# EAGLE design lorasniff (EAGLE 7.7.0)
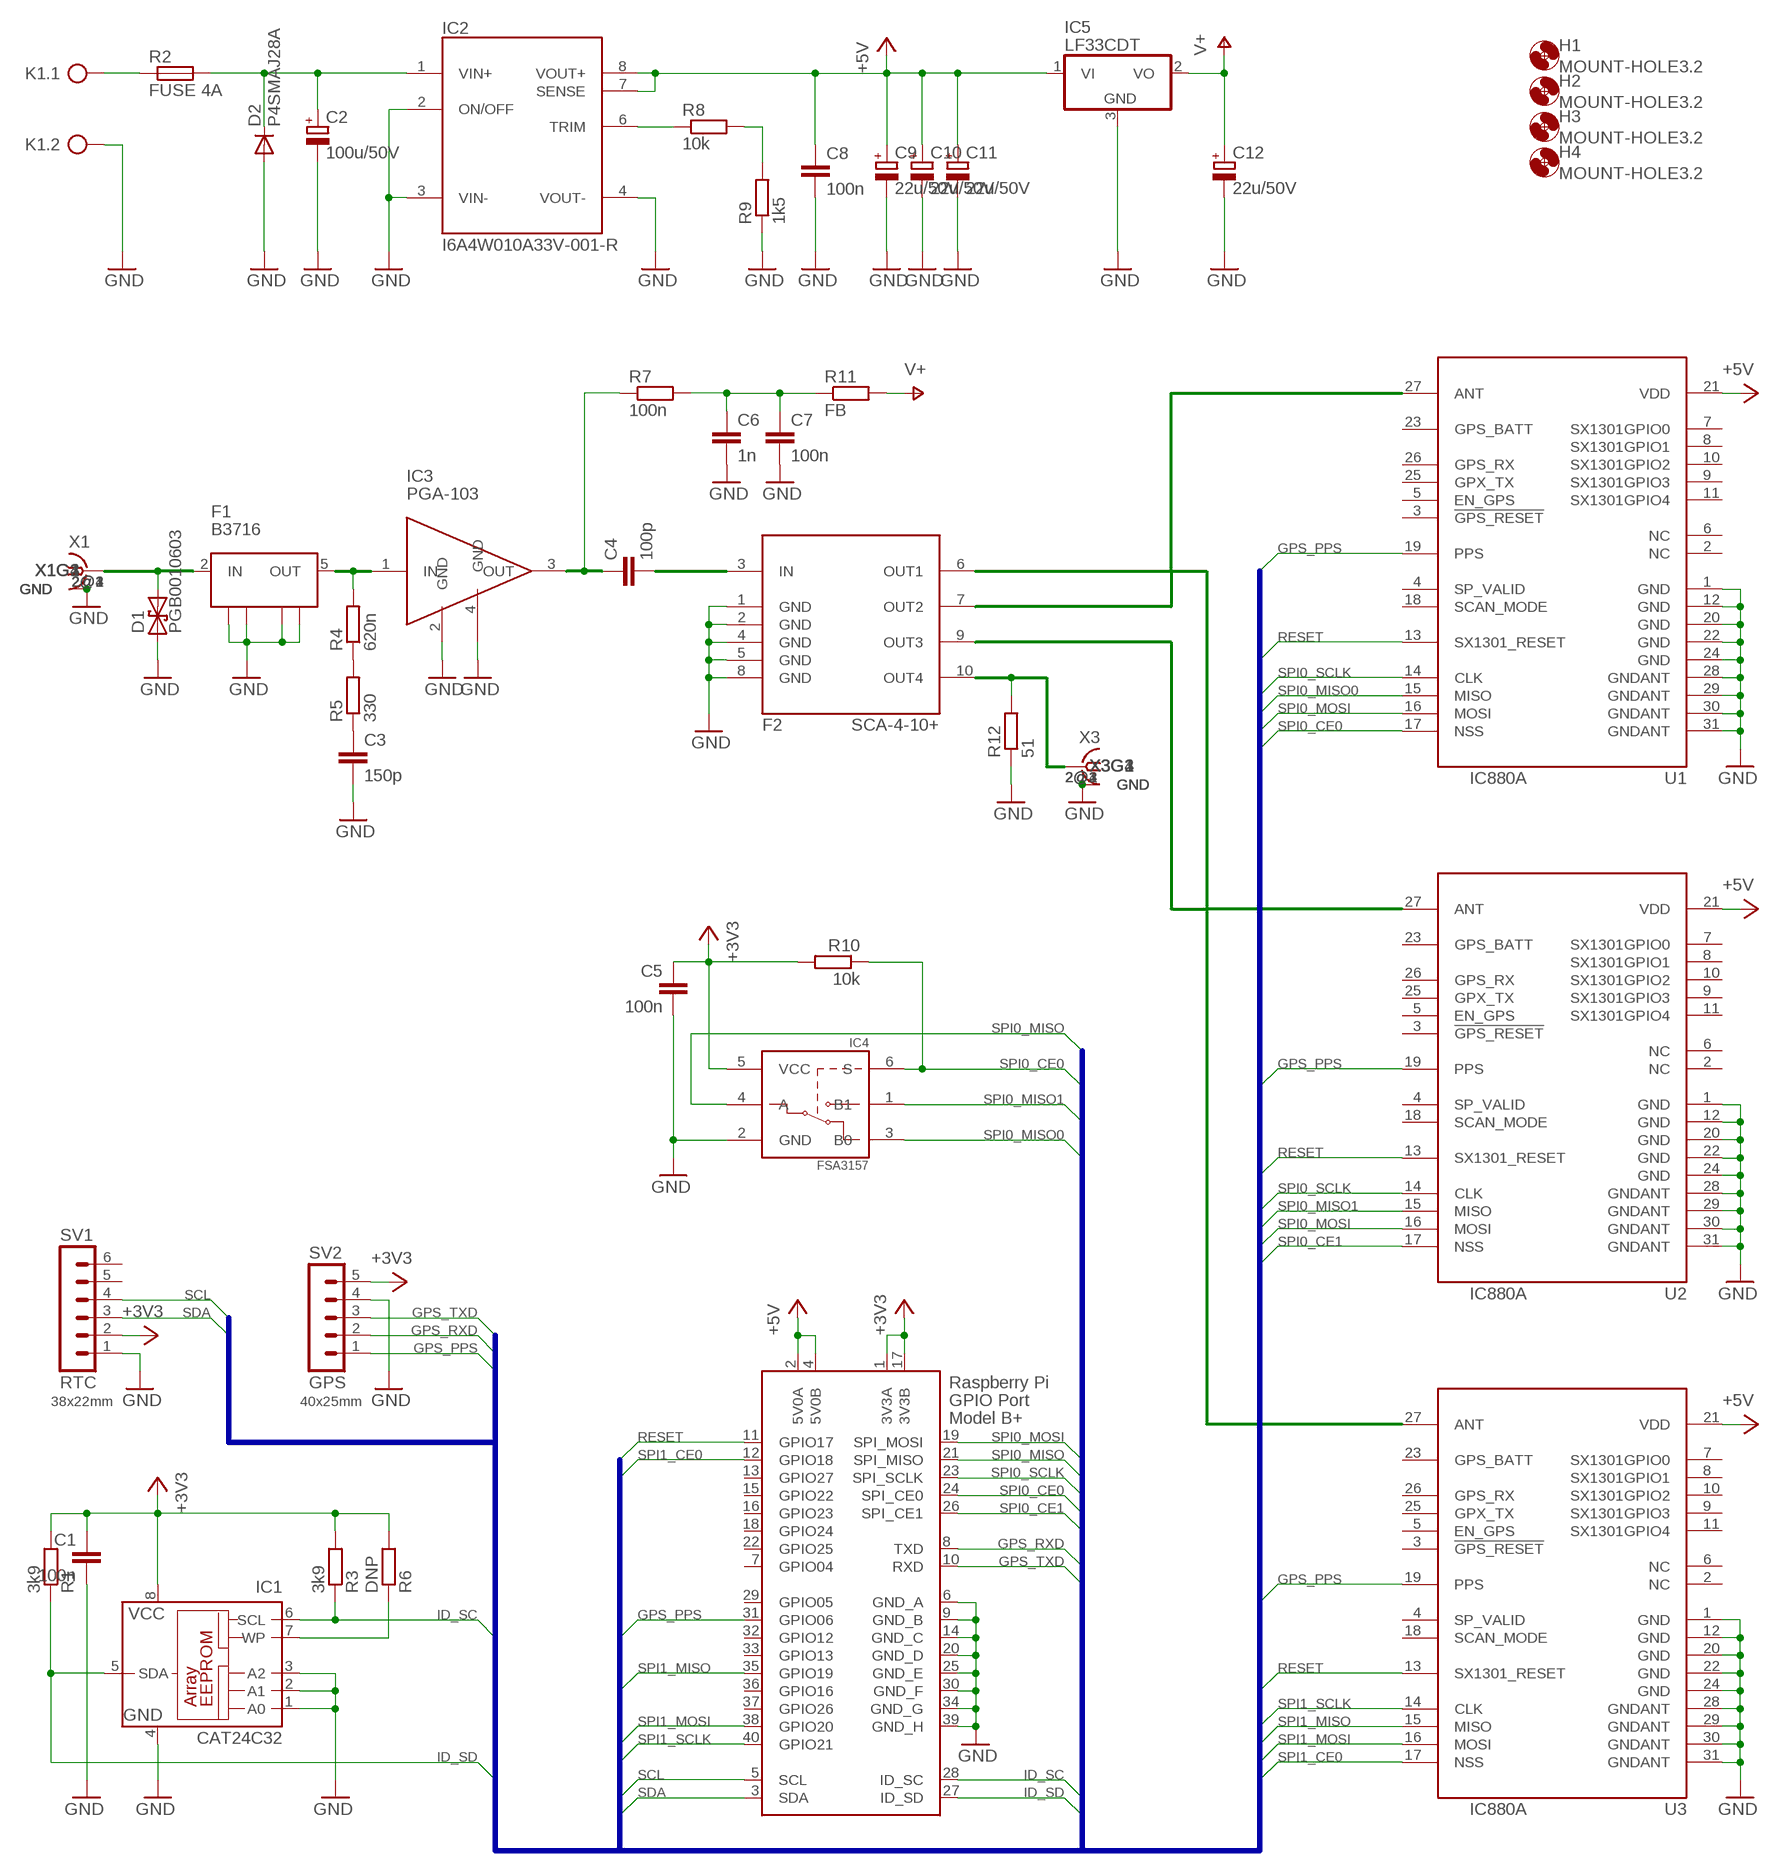
[diagram p0: schematic, sheet 1]

## Parts
C1  100n  C-EUC0603K  [C0603K]
C2  100u/50V  CPOL-EUE5-10.5  [E5-10,5]
C3  150p  C-EUC0603K  [C0603K]
C4  100p  C-EUC0603K  [C0603K]
C5  100n  C-EUC0603K  [C0603K]
C6  1n  C-EUC0603K  [C0603K]
C7  100n  C-EUC0603K  [C0603K]
C8  100n  C-EUC0603K  [C0603K]
C9  22u/50V  CPOL-EUE2.5-5  [E2,5-5]
C10  22u/50V  CPOL-EUE2.5-5  [E2,5-5]
C11  22u/50V  CPOL-EUE2.5-5  [E2,5-5]
C12  22u/50V  CPOL-EUE2.5-5  [E2,5-5]
D1  PGB0010603  [0603]
D2  P4SMAJ28A  DIODE-DO214AC  [DO214AC]
F1  B3716  [DCC6C]
F2  SCA-4-10+  [SCA-4-10+]
H1  MOUNT-HOLE3.2  [3,2]
H2  MOUNT-HOLE3.2  [3,2]
H3  MOUNT-HOLE3.2  [3,2]
H4  MOUNT-HOLE3.2  [3,2]
IC1  CAT24C32  24C04SN  [SO-08]
IC2  I6A4W010A33V-001-R  [I6A4W]
IC3  PGA-103  [SOT89]
IC4  FSA3157  [SC70-6L]
IC5  LF33CDT  7805DT  [TO252]
K1  ARK950H/2  [ARK950H/2]
R1  3k9  R-EU_R0603  [R0603]
R2  FUSE 4A  R-EU_R1206  [R1206]
R3  3k9  R-EU_R0603  [R0603]
R4  620n  R-EU_R0603  [R0603]
R5  330  R-EU_R0603  [R0603]
R6  DNP  R-EU_R0603  [R0603]
R7  100n  R-EU_R0603  [R0603]
R8  10k  R-EU_R0603  [R0603]
R9  1k5  R-EU_R0603  [R0603]
R10  10k  R-EU_R0603  [R0603]
R11  FB  R-EU_R0603  [R0603]
R12  51  R-EU_R0603  [R0603]
SV1  RTC  MA06-1  [MA06-1]
SV2  GPS  MA05-1  [MA05-1]
U1  IC880A  [IC880A]
U2  IC880A  [IC880A]
U3  IC880A  [IC880A]
X1  SMA-DX-L  [BU-SMA-L]
X2  RASPI_BOARD_B+#_FP  [RASPI_BOARD_B+_FULL_PAD]
X3  SMA-DX-L  [BU-SMA-L]

## Nets
+3V3: C1.1 C5.1 IC1.8(VCC) IC4.5(VCC) R1.2 R3.2 R6.2 R10.2 SV1.2 SV2.5 X2.1(3V3A) X2.17(3V3B)
+5V: C8.1 C9.+ C10.+ C11.+ IC2.7(SENSE) IC2.8(VOUT+) IC5.1(VI) U1.21(VDD) U2.21(VDD) U3.21(VDD) X2.2(5V0A) X2.4(5V0B)
GND: C1.2 C2.- C3.2 C5.2 C6.2 C7.2 C8.2 C9.- C10.- C11.- C12.- D1.1 D2.A F1.1(GND) F1.3(GND1) F1.4(GND2) F1.6(GND3) F2.1(GND) F2.2(GND) F2.4(GND) F2.5(GND) F2.8(GND) IC1.1(A0) IC1.2(A1) IC1.3(A2) IC1.4(GND) IC2.2(ON/OFF) IC2.3(VIN-) IC2.4(VOUT-) IC3.2(GND) IC3.4(GND) IC4.2(GND) IC5.3(GND) K1.2 R9.1 R12.1 SV1.1 SV2.4 U1.1(GND) U1.12(GND) U1.20(GND) U1.22(GND) U1.24(GND) U1.28(GNDANT) U1.29(GNDANT) U1.30(GNDANT) U1.31(GNDANT) U2.1(GND) U2.12(GND) U2.20(GND) U2.22(GND) U2.24(GND) U2.28(GNDANT) U2.29(GNDANT) U2.30(GNDANT) U2.31(GNDANT) U3.1(GND) U3.12(GND) U3.20(GND) U3.22(GND) U3.24(GND) U3.28(GNDANT) U3.29(GNDANT) U3.30(GNDANT) U3.31(GNDANT) X1.2@1 X1.2@2 X1.2@3 X1.2@4 X2.6(GND_A) X2.9(GND_B) X2.14(GND_C) X2.20(GND_D) X2.25(GND_E) X2.30(GND_F) X2.34(GND_G) X2.39(GND_H) X3.2@1 X3.2@2 X3.2@3 X3.2@4
GPS_PPS: SV2.1 U1.19(PPS) U2.19(PPS) U3.19(PPS) X2.31(GPIO06)
GPS_RXD: SV2.2 X2.8(TXD)
GPS_TXD: SV2.3 X2.10(RXD)
ID_SC: IC1.6(SCL) R3.1 X2.28(ID_SC)
ID_SD: IC1.5(SDA) R1.1 X2.27(ID_SD)
N$1: C2.+ D2.C IC2.1(VIN+) R2.2
N$2: F2.9(OUT3) U2.27(ANT)
N$3: C4.2 F2.3(IN)
N$4: IC1.7(WP) R6.1
N$5: C4.1 IC3.3(OUT) R7.1
N$6: D1.2 F1.2(IN) X1.1
N$7: R4.1 R5.2
N$8: C3.1 R5.1
N$9: F1.5(OUT) IC3.1(IN) R4.2
N$10: F2.10(OUT4) R12.2 X3.1
N$11: C6.1 C7.1 R7.2 R11.1
N$12: F2.7(OUT2) U1.27(ANT)
N$13: F2.6(OUT1) U3.27(ANT)
N$14: K1.1 R2.1
N$19: IC2.6(TRIM) R8.1
N$20: R8.2 R9.2
RESET: U1.13(SX1301_RESET) U2.13(SX1301_RESET) U3.13(SX1301_RESET) X2.11(GPIO17)
SCL: SV1.4 X2.5(SCL)
SDA: SV1.3 X2.3(SDA)
SPI0_CE0: IC4.6(S) R10.1 U1.17(NSS) X2.24(SPI_CE0)
SPI0_CE1: U2.17(NSS) X2.26(SPI_CE1)
SPI0_MISO: IC4.4(A) X2.21(SPI_MISO)
SPI0_MISO0: IC4.3(B0) U1.15(MISO)
SPI0_MISO1: IC4.1(B1) U2.15(MISO)
SPI0_MOSI: U1.16(MOSI) U2.16(MOSI) X2.19(SPI_MOSI)
SPI0_SCLK: U1.14(CLK) U2.14(CLK) X2.23(SPI_SCLK)
SPI1_CE0: U3.17(NSS) X2.12(GPIO18)
SPI1_MISO: U3.15(MISO) X2.35(GPIO19)
SPI1_MOSI: U3.16(MOSI) X2.38(GPIO20)
SPI1_SCLK: U3.14(CLK) X2.40(GPIO21)
V+: C12.+ IC5.2(VO) R11.2
Unconnected: SV1.5 SV1.6 U1.2(NC) U1.3(!GPS_RESET) U1.4(SP_VALID) U1.5(EN_GPS) U1.6(NC) U1.7(SX1301GPIO0) U1.8(SX1301GPIO1) U1.9(SX1301GPIO3) U1.10(SX1301GPIO2) U1.11(SX1301GPIO4) U1.18(SCAN_MODE) U1.23(GPS_BATT) U1.25(GPX_TX) U1.26(GPS_RX) U2.2(NC) U2.3(!GPS_RESET) U2.4(SP_VALID) U2.5(EN_GPS) U2.6(NC) U2.7(SX1301GPIO0) U2.8(SX1301GPIO1) U2.9(SX1301GPIO3) U2.10(SX1301GPIO2) U2.11(SX1301GPIO4) U2.18(SCAN_MODE) U2.23(GPS_BATT) U2.25(GPX_TX) U2.26(GPS_RX) U3.2(NC) U3.3(!GPS_RESET) U3.4(SP_VALID) U3.5(EN_GPS) U3.6(NC) U3.7(SX1301GPIO0) U3.8(SX1301GPIO1) U3.9(SX1301GPIO3) U3.10(SX1301GPIO2) U3.11(SX1301GPIO4) U3.18(SCAN_MODE) U3.23(GPS_BATT) U3.25(GPX_TX) U3.26(GPS_RX) X2.7(GPIO04) X2.13(GPIO27) X2.15(GPIO22) X2.16(GPIO23) X2.18(GPIO24) X2.22(GPIO25) X2.29(GPIO05) X2.32(GPIO12) X2.33(GPIO13) X2.36(GPIO16) X2.37(GPIO26)

## Buses
SPI0_MOSI,SPI0_MISO0,SPI0_MISO1,SPI0_SCLK,SPI0_CE0,SPI0_CE1,SPI1_MOSI,SPI1_MISO,SPI1_SCLK,SPI1_CE0,RESET,SDA,SCL,ID_SD,ID_SC,GPS_RXD,GPS_TXD,GPS_PPS

## Notes on the sheet
- 38x22mm | 40x25mm

## Library data of the parts
C1 C3-C8 = rcl:C-EU: CAPACITOR, European symbol
C2 C9-C12 = rcl:CPOL-EU: POLARIZED CAPACITOR, European symbol
D1 = chimp_metra:PGB0010603: Littelfuse PGB Series 0603 PulseGuard Suppressor
D2 = diode:DIODE-: DIODE
F1 = chimp_metra:B3716: EPCOS SAW FILTER B3716 869 MHz
F2 = lora:SCA-4-10+
H1-H4 = holes:MOUNT-HOLE: MOUNTING HOLE with drill center marker
IC1 = microchip:24C*: Serial EEPROM 1 K/2 K/4 K; MPN: M24C04-WMN6P; OC_FARNELL: 9882812; OC_NEWARK: 83K1376
IC2 = lora:I6A4W010A33V-001-R
IC3 = pga103:PGA-103
IC4 = alpov:FSA3157
IC5 = linear:78*: Positive VOLTAGE REGULATOR Source: http://cache.national.com/ds/LM/LM78L05.pdf http://www.fairchildsemi.com/ds/LM/LM7805.pdf
K1 = con-ark:ARK950H/2
R1-R12 = rcl:R-EU_: RESISTOR, European symbol
SV1 = con-lstb:MA06-1: PIN HEADER; OC_FARNELL: unknown; OC_NEWARK: unknown
SV2 = con-lstb:MA05-1: PIN HEADER; OC_FARNELL: unknown; OC_NEWARK: unknown
U1-U3 = lora:IC880A
X1 X3 = alpov:SMA-DX: FEMALE SMA CONNECTOR Radiall distributor RS 112-3794
X2 = raspberrypi_bastelstube_v13:RASPI_BOARD_B+#: Raspberry Pi GPIO connector with markings for the outer dimensions of the Raspberry Pi board model B+ with different sets of drill holes or mounting pads All pins connected

## Board
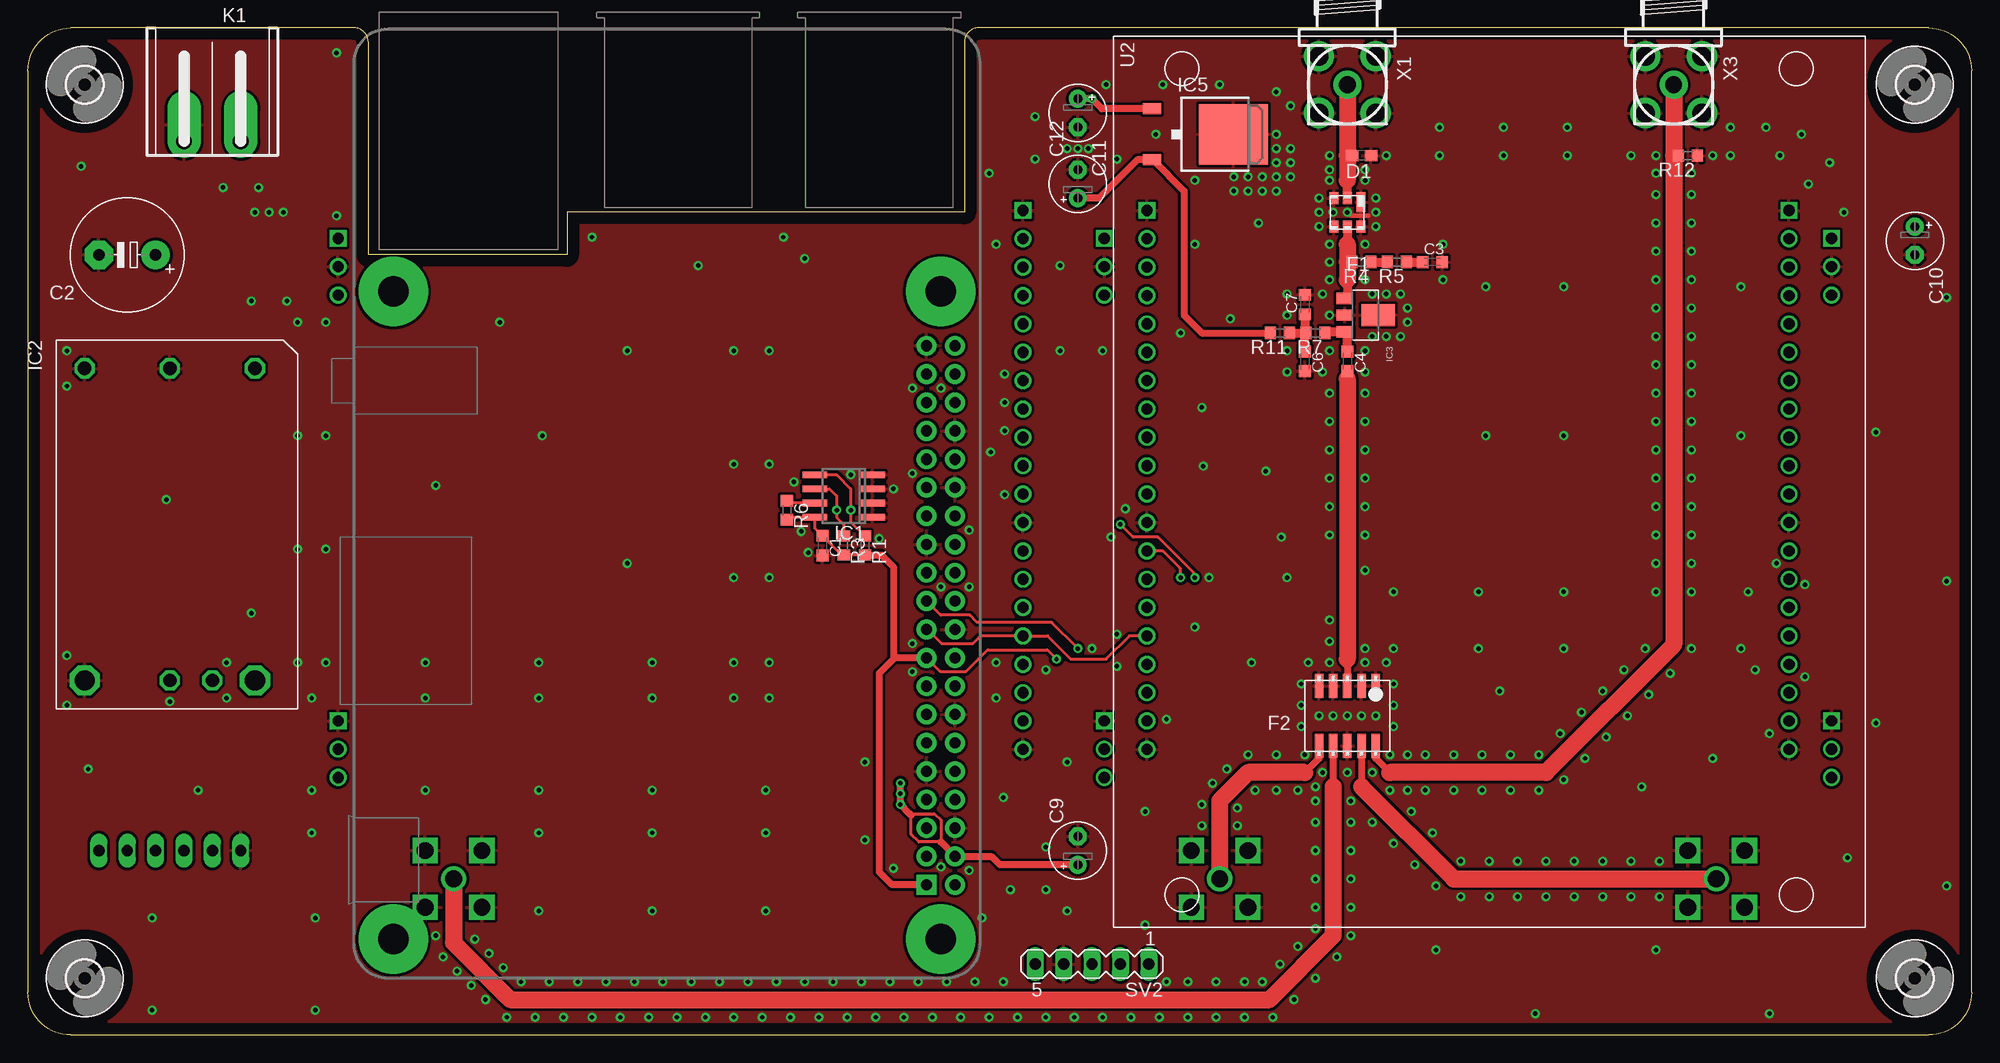
[diagram p1: board, top side]
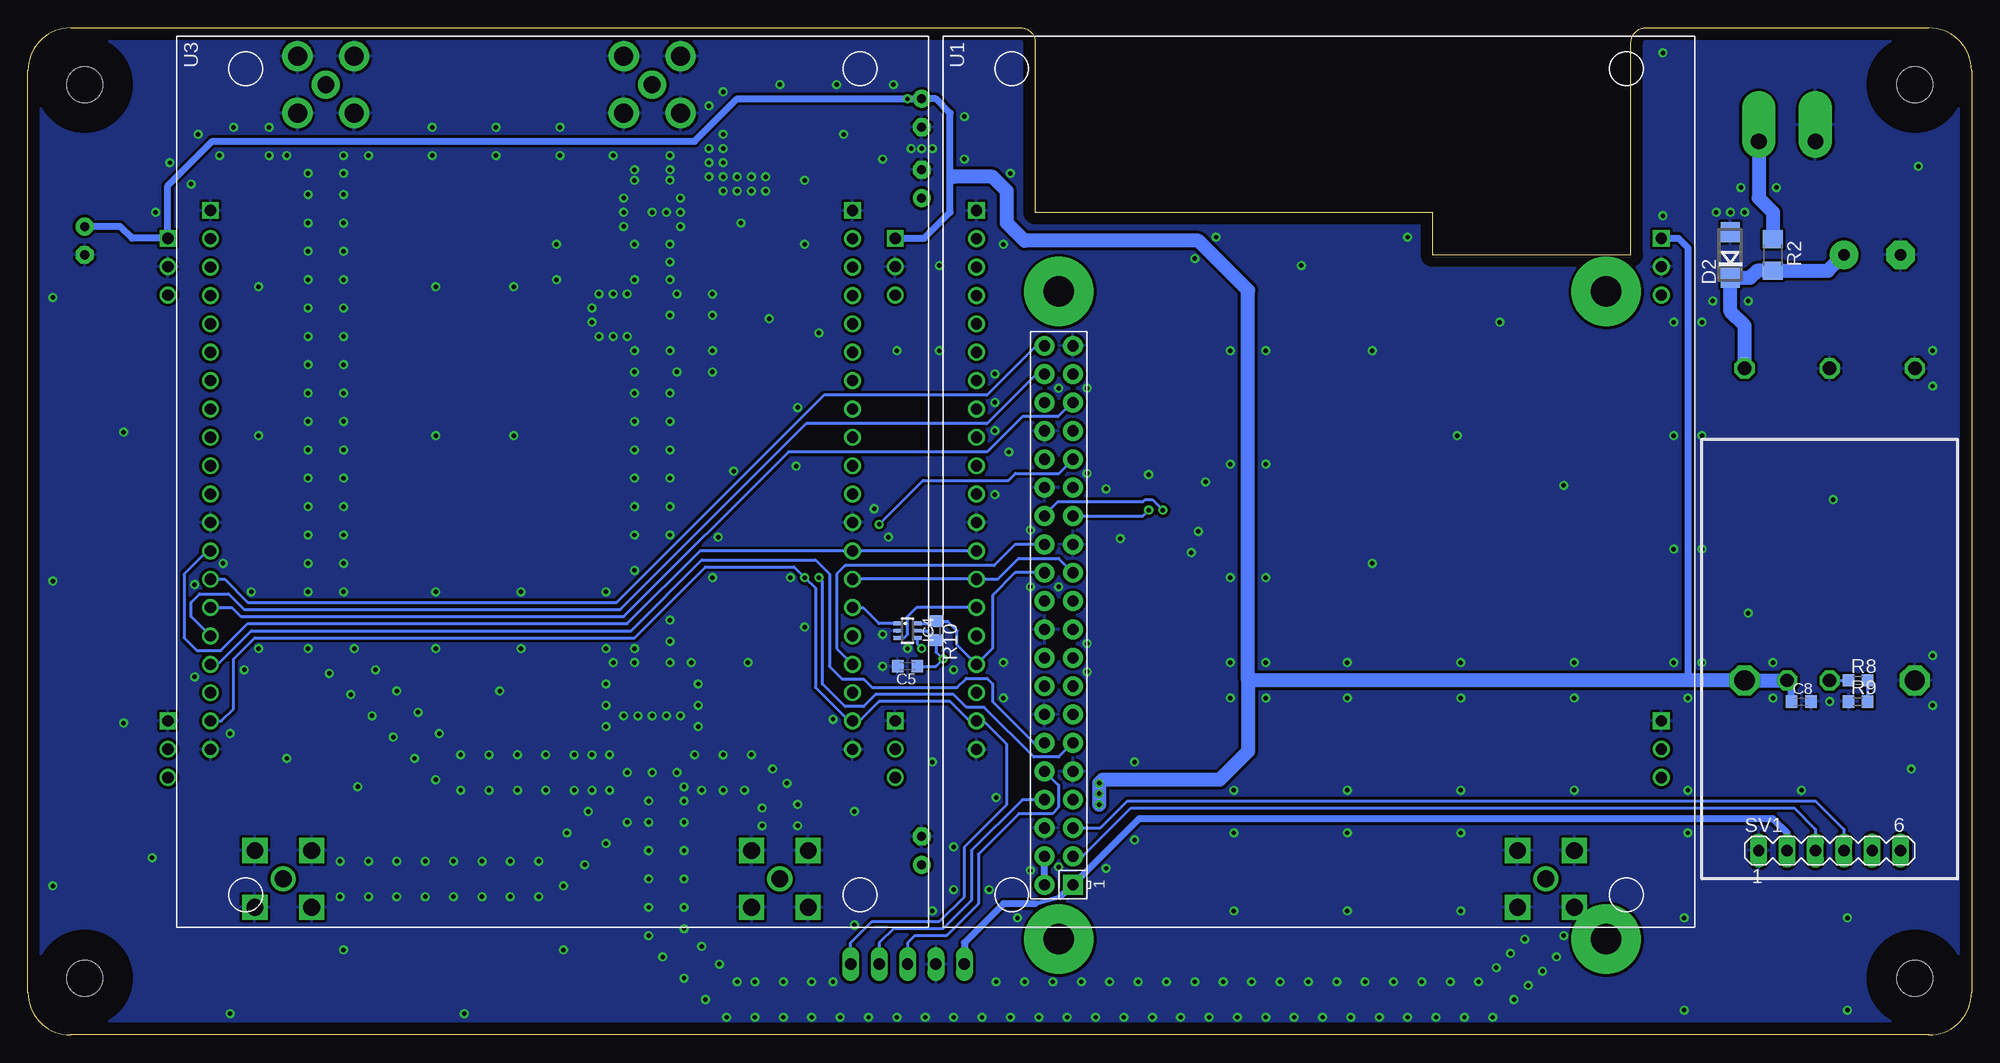
[diagram p2: board, bottom side, seen from below]

Size 173.99 x 90.17 mm. Coordinates in mm from the lower left corner, seen from the top.
Outline: 173.99,3.81 173.99,86.36 arc90 170.18,90.17 85.09,90.17 arc90 83.82,88.9 83.82,73.66 48.26,73.66 48.26,69.85 30.48,69.85 30.48,88.9 arc90 29.21,90.17 3.81,90.17 arc90 0,86.36 0,3.81 arc90 3.81,0 170.18,0 arc90 173.99,3.81
Copper layers (1*16): Top 0.035mm / dielectric 1.5mm / Bottom 0.035mm
Design rules "default *": minimum track width 10mil, minimum drill 0.4mm, track to track 8mil, track to pad 8mil, pad to pad 8mil, via to via 8mil, smd to smd 8mil, copper to edge 40mil, drill to drill 8mil, minimum pad ring 10mil, minimum via ring 8mil, stop-mask expansion 4mil, vias tented up to drill 0.4mm, thermal gap 10mil

### Footprints (pad centres in the part's own frame; a part is rotated, then mirrored left to right if it is on the bottom)
C0603K = smd 1.05 x 1.08: 1 -0.875,0; 2 0.875,0
E5-10,5 = drill 1.016 pad 2.54: + -2.54,0 | drill 1.016 pad 2.54 octagon: - 2.54,0
E2,5-5 = drill 0.813 pad 1.6: + -1.27,0 | drill 0.813 pad 1.6 octagon: - 1.27,0
0603 = smd 1.1 x 1: 1 -0.85,0; 2 0.85,0
DO214AC = smd 1.8 x 1.7: A 2.05,0; C -2.05,0
DCC6C = smd 0.8 x 1.8: 1 -1.2,-0.9 | smd 0.8 x 1.05: 2 0,-1.275; 3 1.2,-1.275; 4 1.2,1.275; 5 0,1.275; 6 -1.2,1.275
SCA-4-10+ = smd 0.762 x 2.159: 1 -2.54,-2.68; 2 -1.27,-2.68; 3 0,-2.68; 4 1.27,-2.68; 5 2.54,-2.68; 6 2.54,2.68; 7 1.27,2.68; 8 0,2.68; 9 -1.27,2.68; 10 -2.54,2.68
3,2 = hole 3.2: 0,0
SO-08 = smd 0.6 x 2.2: 1 -1.905,-2.6; 2 -0.635,-2.6; 3 0.635,-2.6; 4 1.905,-2.6; 5 1.905,2.6; 6 0.635,2.6; 7 -0.635,2.6; 8 -1.905,2.6
I6A4W = drill 1.2 octagon: 1 0,15.24; 2 0,7.62; 3 0,0; 6 27.94,7.62; 7 27.94,11.43 | drill 1.8 octagon: 4 27.94,0; 8 27.94,15.24
SOT89 = smd 1 x 1.5: 1 -1.5,-1.5; 2 0,-1.5; 3 1.5,-1.5 | smd 2 x 3: 4 0,1.5
SC70-6L = smd 0.35 x 0.8: 1 -0.65,-0.85; 2 0,-0.85; 3 0.65,-0.85; 4 0.65,0.85; 5 0,0.85; 6 -0.65,0.85
TO252 = smd 1 x 1.6: 1 -2.28,-4.8; 2 2.28,-4.8 | smd 5.4 x 6.2: 3 0,2.5
ARK950H/2 = drill 1.4 pad 3 offset: 1 -2.54,1.27; 2 2.54,1.27
R0603 = smd 1 x 1.1: 1 -0.85,0; 2 0.85,0
R1206 = smd 1.6 x 1.803: 1 -1.422,0; 2 1.422,0
MA06-1 = drill 1.016 long: 1 -6.35,0; 2 -3.81,0; 3 -1.27,0; 4 1.27,0; 5 3.81,0; 6 6.35,0
MA05-1 = drill 1.016 long: 1 -5.08,0; 2 -2.54,0; 3 0,0; 4 2.54,0; 5 5.08,0
IC880A = drill 1 square: 1 -24.3,-30.65; 21 -21.8,30.65; 24 21.4,30.65 | drill 1: 2 -21.76,-30.65; 3 -19.22,-30.65; 4 -16.68,-30.65; 5 -14.14,-30.65; 6 -11.6,-30.65; 7 -9.06,-30.65; 8 -6.52,-30.65; 9 -3.98,-30.65; 10 -1.44,-30.65; 11 1.1,-30.65; 12 3.64,-30.65; 13 6.18,-30.65; 14 8.72,-30.65; 15 11.26,-30.65; 16 13.8,-30.65; 17 16.34,-30.65; 18 18.88,-30.65; 19 21.42,-30.65; 20 23.96,-30.65; 22 -19.26,30.65; 23 -16.72,30.65; 25 23.94,30.65; 26 26.48,30.65 | drill 1.5: 27 35.56,20.32 | drill 1.5 square: 28 33.02,22.86; 29 38.1,22.86; 30 38.1,17.78; 31 33.02,17.78
BU-SMA-L = drill 1.5 pad 2.5: 1 0,0 | drill 1.7 pad 2.7: 2@1 -2.54,2.54; 2@2 2.54,2.54; 2@3 -2.54,-2.54; 2@4 2.54,-2.54
RASPI_BOARD_B+_FULL_PAD = drill 1 pad 1.778 square: 1 8.37,51.23 | drill 1 pad 1.778: 2 8.37,53.77; 3 10.91,51.23; 4 10.91,53.77; 5 13.45,51.23; 6 13.45,53.77; 7 15.99,51.23; 8 15.99,53.77; 9 18.53,51.23; 10 18.53,53.77; 11 21.07,51.23; 12 21.07,53.77; 13 23.61,51.23; 14 23.61,53.77; 15 26.15,51.23; 16 26.15,53.77; 17 28.69,51.23; 18 28.69,53.77; 19 31.23,51.23; 20 31.23,53.77; 21 33.77,51.23; 22 33.77,53.77; 23 36.31,51.23; 24 36.31,53.77; 25 38.85,51.23; 26 38.85,53.77; 27 41.39,51.23; 28 41.39,53.77; 29 43.93,51.23; 30 43.93,53.77; 31 46.47,51.23; 32 46.47,53.77; 33 49.01,51.23; 34 49.01,53.77; 35 51.55,51.23; 36 51.55,53.77; 37 54.09,51.23; 38 54.09,53.77; 39 56.63,51.23; 40 56.63,53.77 | drill 2.75 pad 6.2: DRILL_1 3.5,52.5; DRILL_2 61.5,52.5; DRILL_3 3.5,3.5; DRILL_4 61.5,3.5

### Placement (x,y rotation side)
C1  71.12,43.81 270 top
C2  8.89,69.85 180 top
C3  125.73,69.22 0 top
C4  118.11,60.33 270 top
C5  95.25,33.02 180 bottom
C6  114.3,60.33 270 top
C7  114.3,65.41 90 top
C8  15.24,29.84 0 bottom
C9  93.98,16.51 90 top
C10  168.91,71.12 270 top
C11  93.98,82.55 270 top
C12  93.98,76.2 90 top
D1  119.38,78.74 180 top
D2  21.59,69.85 90 bottom
F1  118.11,73.66 180 top
F2  118.11,28.57 180 top
H1  168.91,5.08 90 top
H2  168.91,85.09 90 top
H3  5.08,5.08 90 top
H4  5.08,85.09 90 top
IC1  73.03,48.26 90 top
IC2  5.08,59.69 270 top
IC3  119.38,64.45 270 top
IC4  95.25,36.2 270 bottom
IC5  105.41,80.64 270 top
K1  16.51,81.28 180 top
R1  74.93,43.81 270 top
R2  17.78,69.85 270 bottom
R3  73.03,43.81 270 top
R4  119.38,69.22 180 top
R5  122.56,69.22 180 top
R6  67.94,46.99 270 top
R7  115.25,62.87 180 top
R8  10.16,31.75 0 bottom
R9  10.16,29.84 0 bottom
R10  92.71,36.2 270 bottom
R11  112.08,62.87 180 top
R12  148.59,78.74 180 top
SV1  12.7,16.51 0 bottom
SV2  95.25,6.35 180 top
U1  58.42,49.53 270 bottom
U2  130.81,49.53 270 top
U3  127,49.53 270 bottom
X1  118.11,85.09 270 top
X2  29.21,5.08 90 bottom
X3  147.32,85.09 270 top

### Tracks (layer width: path | path; a pad name or v marks a point on that pad's centre or on a via)
+3V3  (via drill 0.4)
  Top 0.254: R6.2 68.16,46.35 IC1.8 70.42,45.38 C1.1 72.84,42.97 R3.2 R1.2 | X2.17 81.7,32.51 83.95,32.51 85.92,34.48 91.25,34.48 v92.08,33.66
  Top 0.61: X2.17 77.58,33.77 77.47,33.66 | 77.47,33.66 77.47,41.91 76.42,42.97 R1.2 | 77.47,33.66 76.2,32.38 76.2,14.61 77.36,13.45 X2.1
  Bottom 0.254: IC4.5 93.56,36.2 R10.2 92.71,34.29 v92.08,33.66 92.71,33.02 C5.1
  Bottom 0.406: 81.6,12.38 83.82,11.75
  Bottom 0.61: SV1.2 16.51,18.1 17.78,19.37 74.52,19.37 X2.1 81.6,12.38 | 83.82,11.75 86.68,11.75 90.17,8.26 SV2.5
+5V  (via drill 0.4)
  Top 0.254: 79.06,19.68 79.06,17.97 79.76,17.27 81.72,17.27 81.72,19.24 81.15,19.81 78.93,19.81
  Top 0.61: IC5.1 96.14,82.92 v95.25,83.82 C11.+ | C9.+ 87,15.24 86.25,15.99 X2.4 82.98,16.02 81.72,17.27 | 79.06,19.68 78.93,19.81 v78.11,20.64 v78.11,21.59 v78.11,22.54
  Bottom 0.61: U3.21 93.77,71.33 91.44,73.66 91.44,76.83 | 91.44,76.83 91.44,82.55 92.71,83.82 C11.+ v95.25,83.82 110.49,83.82 114.3,80.01 157.48,80.01 161.46,76.03 U2.21 164.68,71.33 165.74,72.39 C10.+ | X2.2 X2.4 | C8.1 16.11,31.36 IC2.7 | U1.21 26.25,71.33 25.4,70.48 25.4,31.75 | 91.12,76.83 91.44,76.83
  Bottom 1.27: IC2.7 IC2.8 25.4,31.75 64.77,31.75 | 64.77,31.75 64.77,66.67 69.22,71.12 84.77,71.12 86.36,72.71 86.36,75.56 87.63,76.83 91.12,76.83 | 64.77,31.75 64.77,25.4 67.31,22.86 77.79,22.86 v78.11,22.54 v78.11,21.59 v78.11,20.64
GND  (via drill 0.4)
  Top 0.406: 120.02,73.34 118.43,73.34 v118.11,73.66
  other vias: 115.89,23.5 118.11,23.5 120.33,23.5 114.3,25.08 121.92,25.08 118.43,20.95 121.92,21.91 115.25,22.23 116.52,33.34 119.7,33.34 118.11,28.57 119.38,28.57 120.65,28.57 116.84,28.57 115.57,28.57 97.47,33.02 95.25,34.61 97.47,35.88 116.52,37.15 119.7,34.61 116.52,44.77 119.7,44.77 119.7,41.59 119.7,49.85 119.7,54.93 119.7,59.37 116.52,49.85 116.52,54.93 116.52,61.28 116.52,64.45 120.33,66.36 121.6,66.36 122.87,66.36 120.33,62.55 121.6,62.55 122.87,62.55 126.68,70.8 126.68,67.63 116.52,67.63 116.52,70.8 116.52,69.22 119.7,70.8 119.7,67.63 116.84,73.66 120.65,73.66 120.65,74.93 120.65,72.39 115.57,74.93 115.57,73.66 115.57,72.39 116.52,76.52 119.7,76.52 116.52,78.74 121.6,78.74 119.7,77.47 116.52,77.47 116.52,57.47 119.7,57.47 119.7,52.39 116.52,52.39 116.52,47.31 119.7,47.31 116.52,35.24 114.62,33.34 113.98,31.43 113.98,29.53 122.24,29.53 122.24,31.43 121.6,33.34 113.98,27.62 122.24,27.62 145.73,39.69 148.91,39.69 145.73,42.23 148.91,42.23 148.91,44.77 148.91,47.31 148.91,49.85 148.91,52.39 148.91,54.93 148.91,57.47 148.91,60.01 148.91,62.55 148.91,65.09 148.91,67.63 148.91,70.17 148.91,72.71 148.91,75.25 148.91,77.15 150.81,78.74 145.73,75.25 145.73,77.15 145.73,78.74 145.73,72.71 145.73,70.17 145.73,67.63 145.73,65.09 145.73,62.55 145.73,60.01 145.73,57.47 145.73,54.93 145.73,52.39 145.73,49.85 145.73,47.31 145.73,44.77 144.78,34.61 148.91,34.61 142.88,32.7 140.97,30.8 139.06,28.89 137.16,26.99 135.25,25.08 147,32.38 145.1,30.48 143.19,28.57 141.29,26.67 139.38,24.77 137.48,22.86 132.72,25.08 130.18,25.08 127.64,25.08 125.09,25.08 123.51,25.08 135.25,21.91 132.72,21.91 130.18,21.91 127.64,21.91 125.09,21.91 123.51,21.91 123.83,20 125.73,18.1 128.27,15.56 130.81,15.56 133.35,15.56 135.89,15.56 138.43,15.56 140.97,15.56 143.51,15.56 146.05,15.56 146.05,12.38 143.51,12.38 140.97,12.38 138.43,12.38 135.89,12.38 133.35,12.38 130.81,12.38 128.27,12.38 120.33,19.05 122.24,17.14 124.14,15.24 126.05,13.34 111.76,25.08 109.22,25.08 107.31,23.81 106.05,22.54 105.09,20.64 105.09,18.73 108.27,18.73 108.27,20.32 113.67,21.91 111.76,21.91 109.86,21.91 78.42,1.59 75.88,1.59 73.34,1.59 70.8,1.59 68.26,1.59 65.72,1.59 63.18,1.59 60.64,1.59 58.1,1.59 55.56,1.59 53.02,1.59 50.48,1.59 47.94,1.59 111.44,1.59 108.9,1.59 106.36,1.59 103.82,1.59 101.28,1.59 98.74,1.59 96.2,1.59 93.66,1.59 91.12,1.59 88.58,1.59 86.04,1.59 83.5,1.59 80.96,1.59 74.61,4.76 72.07,4.76 69.53,4.76 66.99,4.76 64.45,4.76 61.91,4.76 59.37,4.76 56.83,4.76 54.29,4.76 51.75,4.76 49.21,4.76 46.67,4.76 44.13,4.76 108.9,4.76 106.36,4.76 103.82,4.76 101.92,4.76 87.31,4.76 84.77,4.76 82.23,4.76 79.69,4.76 77.15,4.76 110.49,4.76 112.08,6.35 113.67,7.94 115.25,9.53 113.35,3.17 115.25,5.08 117.16,6.99 118.43,8.89 118.43,11.43 118.43,13.97 118.43,16.51 118.43,19.05 115.25,11.43 115.25,13.97 115.25,16.51 115.25,19.05 115.25,20.95 42.55,6.03 41.27,7.3 40.01,8.57 45.4,1.59 42.86,1.59 40.96,3.17 39.69,4.45 38.42,5.71 37.15,6.99 36.51,8.89 123.51,63.82 123.51,65.09 115.89,66.36 112.71,66.36 112.71,59.37 115.89,59.37 119.7,61.28 112.71,64.45 112.71,61.28 81.72,40.13 84.26,40.13 84.26,45.21 87.44,54.1 87.44,56.64 87.44,59.18 84.26,14.73 81.72,15.05 81.72,57.91 79.18,32.51 79.18,35.05 79.18,50.29 79.18,57.91 85.41,10.48 87.95,13.02 91.12,13.02 93.03,11.11 100.01,9.84 91.12,16.83 87.31,21.27 86.68,30.16 86.68,33.34 91.12,32.7 93.03,24.45 100.01,20 77.47,14.92 74.93,24.45 74.93,17.46 73.66,50.16 76.2,44.45 69.85,43.18 69.22,45.09 68.58,49.53 77.47,48.9 20.32,73.66 21.59,73.66 22.86,73.66 12.7,29.84 66.04,21.91 66.04,18.1 55.88,18.1 55.88,21.91 45.72,21.91 45.72,18.1 35.56,21.91 25.4,21.91 25.4,18.1 15.24,21.91 55.88,30.16 45.72,30.16 35.56,30.16 25.4,30.16 17.78,30.16 17.78,33.34 24.13,33.34 26.67,33.34 35.56,33.34 45.72,33.34 55.88,33.34 63.18,33.34 63.18,30.16 66.36,33.34 66.36,30.16 63.18,40.96 66.36,40.96 63.18,51.12 66.36,51.12 66.36,61.28 63.18,61.28 69.53,69.53 67.63,71.44 86.68,70.8 86.04,77.15 90.17,78.42 90.17,82.23 93.03,79.38 93.98,79.38 94.93,79.38 92.39,68.9 92.39,61.28 96.2,61.28 86.17,52.2 87.44,48.39 96.96,44.58 98.23,47.12 112.2,44.58 105.22,50.93 105.73,40.96 112.71,40.96 104.46,36.51 101.92,28.26 109.54,33.34 131.76,30.8 110.81,50.48 105.09,56.2 97.47,78.42 104.46,70.8 107.63,64.14 103.19,62.87 26.67,43.5 26.67,53.66 26.67,63.82 24.13,63.82 24.13,53.66 24.13,43.5 20,65.72 23.18,65.72 17.46,75.88 20.64,75.88 27.62,73.34 46.04,53.66 50.48,71.44 27.62,87.95 3.49,61.28 3.49,58.1 3.49,33.97 3.49,29.53 11.11,2.22 25.72,2.22 11.11,10.48 25.72,10.48 55.88,11.11 66.04,11.11 45.72,11.11 155.89,1.91 134.94,1.91 171.77,13.34 171.77,40.64 171.77,66.04 165.42,53.98 165.42,27.94 150.81,24.77 162.88,15.88 145.73,7.62 126.05,7.62 96.52,85.09 101.6,85.09 106.68,85.09 111.76,84.45 100.97,80.64 111.76,80.64 126.36,78.74 132.08,78.74 137.79,78.74 143.51,78.74 137.79,81.28 132.08,81.28 126.36,81.28 152.4,81.28 155.57,81.28 161.29,78.11 162.56,73.66 152.4,78.74 156.84,78.74 159.38,76.2 158.75,80.64 122.24,39.69 122.24,34.61 129.86,34.61 129.86,39.69 137.48,39.69 137.48,34.61 153.99,39.69 153.35,34.61 154.62,32.7 155.89,26.99 156.53,42.23 159.07,32.07 159.07,40.32 153.35,66.99 153.35,53.66 137.48,53.66 137.48,66.99 130.49,53.66 130.49,66.99 144.46,22.23 53.66,61.28 53.66,42.23 36.51,49.21 12.38,47.94 20,37.78 5.4,23.81 4.76,77.79 42.23,63.82 60.01,68.9 104.46,76.52 110.17,72.71 111.76,79.38 111.76,78.11 113.03,78.11 113.03,79.38 113.03,83.19 111.76,76.83 110.49,76.83 109.22,76.83 107.95,76.83 113.03,76.83 111.76,75.56 110.49,75.56 109.22,75.56 107.95,75.56
  pour Top (isolate 0.254): 0,0 0,90.17 173.99,90.17 173.99,0
  pour Bottom (isolate 0.254): 0,0 0,90.17 173.99,90.17 173.99,0
GPS_PPS  (via drill 0.4)
  Top 0.254: v104.46,40.96 104.46,41.27 101.16,44.58 98.93,44.58 v97.79,45.72
  Bottom 0.254: U3.19 156.68,28.11 155.57,29.21 155.57,33.66 153.67,35.56 119.7,35.56 113.35,41.91 105.41,41.91 v104.46,40.96 103.5,40.01 103.5,31.11 100.5,28.11 U2.19 99.53,28.11 97.79,29.84 91.44,29.84 89.7,28.11 U1.19 88.44,28.11 86.36,26.04 86.36,20.64 90.17,16.83 90.17,12.38 92.39,10.16 98.42,10.16 100.33,8.26 SV2.1 | v97.79,45.72 93.85,49.66 86.23,49.66 85.6,50.29 81.7,50.29 X2.31
GPS_RXD
  Bottom 0.254: X2.8 84.97,21.07 89.53,16.51 89.53,12.06 92.08,9.53 96.52,9.53 97.79,8.26 SV2.2
GPS_TXD
  Bottom 0.254: X2.10 81.72,22.35 81.72,20.38 82.3,19.81 85.28,19.81 88.9,16.19 88.9,11.75 91.76,8.89 94.61,8.89 95.25,8.26 SV2.3
ID_SC  (via drill 0.4)
  Top 0.254: IC1.6 71.75,48.9 72.39,48.26 v72.39,46.99 72.39,46.35 73.03,45.72 R3.1
  Bottom 0.254: X2.28 82.98,46.56 81.79,47.75 74.17,47.75 73.98,47.94 73.34,47.94 v72.39,46.99
ID_SD  (via drill 0.4)
  Top 0.254: IC1.5 72.39,50.16 73.66,48.9 v73.66,46.99 73.66,45.94 R1.1
  Bottom 0.254: X2.27 74.18,46.47 v73.66,46.99
N$1
  Bottom 1.27: C2.+ 12.85,68.43 R2.2 19.2,68.43 19.83,67.8 D2.C 21.59,64.77 20.32,63.5 IC2.1
N$2
  Top 0.61: F2.9 119.38,22.23
  Top 1.52: 119.38,22.23 127.64,13.97 U2.27
N$3
  Top 0.61: 118.11,33.66 F2.3
  Top 0.813: C4.2 118.11,58.74
  Top 1.52: 118.11,58.74 118.11,33.66
N$4
  Top 0.254: IC1.7 68.16,47.62 R6.1
N$5
  Top 0.813: R7.1 116.19,62.95 IC3.3 118.11,62.72 C4.1
N$6
  Top 0.813: F1.2 118.11,76.52 | D1.2 118.11,78.74
  Top 1.52: X1.1 118.11,78.74 118.11,76.52
N$7
  Top 0.813: R4.1 R5.2
N$8
  Top 0.813: R5.1 C3.1
N$9
  Top 0.813: F1.5 118.11,70.8 | 118.11,67.63 118.11,66.18 IC3.1 | R4.2 118.11,69.22
  Top 1.52: 118.11,70.8 118.11,69.22 118.11,67.63
N$10
  Top 0.61: F2.10 120.65,24.77 121.92,23.5 | R12.2 147.32,78.74
  Top 1.52: X3.1 147.32,78.74 147.32,34.92 135.89,23.5 121.92,23.5
N$11
  Top 0.813: R11.1 R7.2 | C6.1 114.3,62.76 R7.2 | C7.1 114.3,62.97 R7.2
N$12
  Top 0.61: F2.7 116.84,22.23
  Top 1.52: 116.84,22.23 116.84,8.89 111.12,3.17 43.18,3.17 38.1,8.26 U1.27
N$13
  Top 0.61: F2.6 115.57,24.77 114.3,23.5
  Top 1.52: 114.3,23.5 109.22,23.5 106.68,20.95 U3.27
N$14
  Bottom 1.27: K1.1 19.05,74.93 17.78,73.66 R2.1
N$19
  Bottom 0.254: IC2.6 R8.1
N$20
  Bottom 0.254: R9.2 R8.2
RESET  (via drill 0.4)
  Top 0.254: U2.13 101.6,43.35 103.19,41.76 v103.19,40.96
  Bottom 0.254: U1.13 U2.13 113.81,43.35 120.33,36.83 154.31,36.83 156.72,34.42 158.88,34.42 160.02,35.56 160.02,41.27 157.94,43.35 U3.13 | X2.11 80.47,26.15 81.72,24.89 83.95,24.89 88.39,29.34 89.98,29.34 91.12,30.48 98.11,30.48 99.19,29.4 100.84,29.4 102.87,31.43 102.87,40.64 v103.19,40.96
SCL
  Bottom 0.254: X2.5 77.99,18.53 75.56,20.95 13.97,20.95 11.43,18.41 SV1.4
SDA
  Bottom 0.254: X2.3 79.58,15.99 75.25,20.32 15.88,20.32 13.97,18.41 SV1.3
SPI0_CE0
  Bottom 0.254: IC4.6 92.91,36.84 R10.1 | 92.5,36.83 R10.1 | X2.24 85.61,41.39 87.63,39.37 87.63,34.63 U1.17 90.81,34.92 90.81,36.2 91.66,37.05 R10.1
SPI0_CE1
  Bottom 0.254: X2.26 85.61,43.93 87.5,42.04 100.84,42.04 101.6,41.27 101.6,34.63 U2.17
SPI0_MISO  (via drill 0.4)
  Top 0.254: v93.98,34.61 91.63,36.96 84.96,36.96 84.33,37.59 81.7,37.59 X2.21
  Bottom 0.254: IC4.4 94.4,35.03 v93.98,34.61
SPI0_MISO0
  Bottom 0.254: IC4.3 95.58,35.55 95.25,35.88 95.25,37.47 94.44,38.27 U1.15
SPI0_MISO1
  Bottom 0.254: IC4.1 97.81,36.84 99.23,38.27 U2.15
SPI0_MOSI
  Top 0.254: X2.19 80.53,36.31 81.79,35.05 84.58,35.05 85.26,35.73 U1.16 91.27,35.73 93.34,33.66 96.52,33.66 98.59,35.73 U2.16
SPI0_SCLK
  Bottom 0.254: U2.14 U1.14 87.17,40.81 85.3,42.67 81.72,42.67 X2.23
SPI1_CE0
  Bottom 0.254: U3.17 156.99,33.19 153.99,36.2 120.02,36.2 113.67,42.55 103.5,42.55 102.23,41.27 102.23,33.02 101.09,31.88 99.19,31.88 98.42,31.11 90.81,31.11 89.98,31.94 88.14,31.94 87.63,31.43 87.63,29.84 83.94,26.15 X2.12
SPI1_MISO
  Bottom 0.254: X2.35 80.53,56.63 81.79,55.37 84.96,55.37 88.14,52.2 105.92,52.2 120.65,37.47 154.94,37.47 155.75,38.27 U3.15
SPI1_MOSI
  Bottom 0.254: X2.38 83.7,59.17 88.14,54.74 104.33,54.74 120.97,38.1 154.62,38.1 156.02,39.5 158.62,39.5 159.38,38.73 159.38,37.47 U3.16
SPI1_SCLK
  Bottom 0.254: X2.40 83.7,61.71 88.14,57.28 102.74,57.28 121.28,38.73 154.31,38.73 156.38,40.81 U3.14
V+
  Top 0.61: C12.+ 95.89,74.93 99.32,78.36 IC5.2 100.7,78.36 103.5,75.56 103.5,64.45 105.09,62.87 R11.2

### Text on the board
potisk: RF IN | 9-26V | RF MON | - | + | GPS